# Altium schematic sheet Imx6ull.SchDoc
size 299 x 312 mm; SheetNumber: 3; SheetTotal: 4
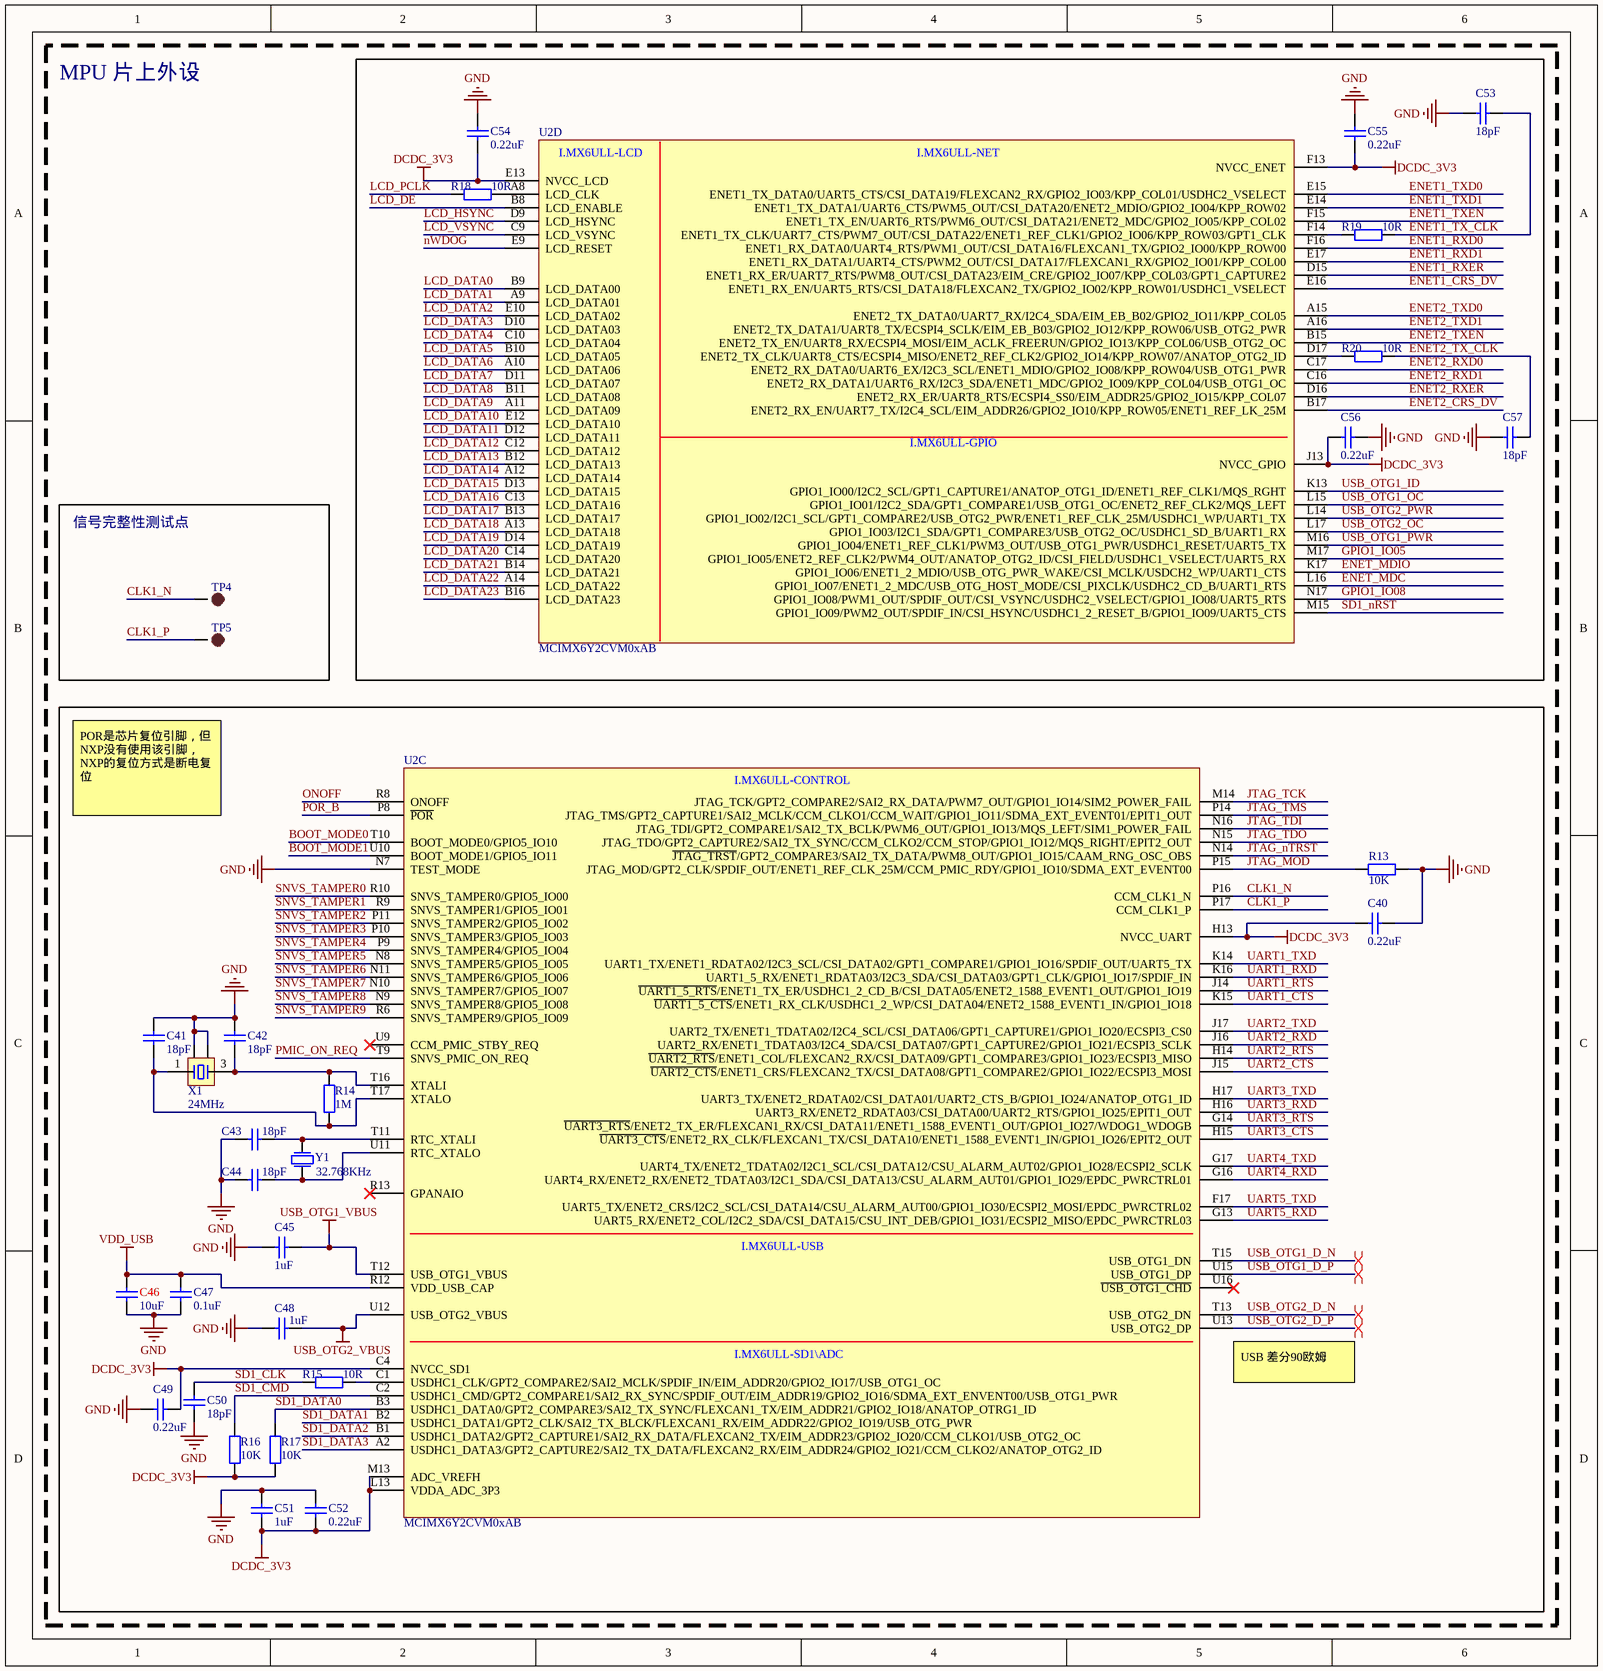
[diagram p0: Imx6ull.SchDoc]

## Parts
C40  0.22uF  [0402_C]
C41  18pF  [0402_C]
C42  18pF  [0402_C]
C43  18pF  [0402_C]
C44  18pF  [0402_C]
C45  1uF  [0402_C]
C46  10uF  [0603_C _MINI]
C47  0.1uF  [0402_C]
C48  1uF  [0402_C]
C49  0.22uF  [0402_C]
C50  18pF  [0402_C]
C51  1uF  [0402_C]
C52  0.22uF  [0402_C]
C53  18pF  [0402_C]
C54  0.22uF  [0402_C]
C55  0.22uF  [0402_C]
C56  0.22uF  [0402_C]
C57  18pF  [0402_C]
R13  10K  [0402_R]
R14  1M  [0402_R]
R15  10R  [0402_R]
R16  10K  [0402_R]
R17  10K  [0402_R]
R18  10R  [0402_R]
R19  10R  [0402_R]
R20  10R  [0402_R]
TP4  SOC_IN  [TP-1.0]  (value not drawn)
TP5  SOC_IN  [TP-1.0]  (value not drawn)
U2  MCIMX6Y2CVM0xAB  [BGA289_17x17_0.8Pitch]  (parts C,D of 5)
X1  24MHz  [OSC 3225-4P]
Y1  32.768KHz  [OSC 3215-2P]

## Blocks framed on the sheet
信号完整性测试点: TP4 TP5

## Nets
DCDC_3V3: C40.1 C49.2 C51.1 C52.1 C54.1 C55.1 C56.1 R16.1 R17.1 U2.C4(NVCC_SD1) U2.E13(NVCC_LCD) U2.F13(NVCC_ENET) U2.H13(NVCC_UART) U2.J13(NVCC_GPIO) U2.L13(VDDA_ADC_3P3) U2.M13(ADC_VREFH)
GND: C40.2 C41.2 C42.2 C43.1 C44.1 C45.1 C46.1 C47.1 C48.1 C49.1 C50.1 C51.2 C52.2 C53.2 C54.2 C55.2 C56.2 C57.1 R13.2 U2.N7(TEST_MODE) X1.2 X1.4
USB_OTG1_VBUS: C45.2 U2.T12(USB_OTG1_VBUS)
USB_OTG2_VBUS: C48.2 U2.U12(USB_OTG2_VBUS)
VDD_USB: C46.2 C47.2 U2.R12(VDD_USB_CAP)
BOOT_MODE0: U2.T10(BOOT_MODE0/GPIO5_IO10)
BOOT_MODE1: U2.U10(BOOT_MODE1/GPIO5_IO11)
CLK1_N: TP4.1 U2.P16(CCM_CLK1_N)
CLK1_P: TP5.1 U2.P17(CCM_CLK1_P)
ENET1_CRS_DV: U2.E16(ENET1_RX_EN/UART5_RTS/CSI_DATA18/FLEXCAN2_TX/GPIO2_IO02/KPP_ROW01/USDHC1_VSELECT)
ENET1_RXD0: U2.F16(ENET1_RX_DATA0/UART4_RTS/PWM1_OUT/CSI_DATA16/FLEXCAN1_TX/GPIO2_IO00/KPP_ROW00)
ENET1_RXD1: U2.E17(ENET1_RX_DATA1/UART4_CTS/PWM2_OUT/CSI_DATA17/FLEXCAN1_RX/GPIO2_IO01/KPP_COL00)
ENET1_RXER: U2.D15(ENET1_RX_ER/UART7_RTS/PWM8_OUT/CSI_DATA23/EIM_CRE/GPIO2_IO07/KPP_COL03/GPT1_CAPTURE2)
ENET1_TX_CLK: C53.1 R19.2
ENET1_TXD0: U2.E15(ENET1_TX_DATA0/UART5_CTS/CSI_DATA19/FLEXCAN2_RX/GPIO2_IO03/KPP_COL01/USDHC2_VSELECT)
ENET1_TXD1: U2.E14(ENET1_TX_DATA1/UART6_CTS/PWM5_OUT/CSI_DATA20/ENET2_MDIO/GPIO2_IO04/KPP_ROW02)
ENET1_TXEN: U2.F15(ENET1_TX_EN/UART6_RTS/PWM6_OUT/CSI_DATA21/ENET2_MDC/GPIO2_IO05/KPP_COL02)
ENET2_CRS_DV: U2.B17(ENET2_RX_EN/UART7_TX/I2C4_SCL/EIM_ADDR26/GPIO2_IO10/KPP_ROW05/ENET1_REF_LK_25M)
ENET2_RXD0: U2.C17(ENET2_RX_DATA0/UART6_EX/I2C3_SCL/ENET1_MDIO/GPIO2_IO08/KPP_ROW04/USB_OTG1_PWR)
ENET2_RXD1: U2.C16(ENET2_RX_DATA1/UART6_RX/I2C3_SDA/ENET1_MDC/GPIO2_IO09/KPP_COL04/USB_OTG1_OC)
ENET2_RXER: U2.D16(ENET2_RX_ER/UART8_RTS/ECSPI4_SS0/EIM_ADDR25/GPIO2_IO15/KPP_COL07)
ENET2_TX_CLK: C57.2 R20.2
ENET2_TXD0: U2.A15(ENET2_TX_DATA0/UART7_RX/I2C4_SDA/EIM_EB_B02/GPIO2_IO11/KPP_COL05)
ENET2_TXD1: U2.A16(ENET2_TX_DATA1/UART8_TX/ECSPI4_SCLK/EIM_EB_B03/GPIO2_IO12/KPP_ROW06/USB_OTG2_PWR)
ENET2_TXEN: U2.B15(ENET2_TX_EN/UART8_RX/ECSPI4_MOSI/EIM_ACLK_FREERUN/GPIO2_IO13/KPP_COL06/USB_OTG2_OC)
ENET_MDC: U2.L16(GPIO1_IO07/ENET1_2_MDC/USB_OTG_HOST_MODE/CSI_PIXCLK/USDHC2_CD_B/UART1_RTS)
ENET_MDIO: U2.K17(GPIO1_IO06/ENET1_2_MDIO/USB_OTG_PWR_WAKE/CSI_MCLK/USDCH2_WP/UART1_CTS)
GPIO1_IO05: U2.M17(GPIO1_IO05/ENET2_REF_CLK2/PWM4_OUT/ANATOP_OTG2_ID/CSI_FIELD/USDHC1_VSELECT/UART5_RX)
GPIO1_IO08: U2.N17(GPIO1_IO08/PWM1_OUT/SPDIF_OUT/CSI_VSYNC/USDHC2_VSELECT/GPIO1_IO08/UART5_RTS)
JTAG_MOD: R13.1 U2.P15(JTAG_MOD/GPT2_CLK/SPDIF_OUT/ENET1_REF_CLK_25M/CCM_PMIC_RDY/GPIO1_IO10/SDMA_EXT_EVENT00)
JTAG_nTRST: U2.N14(~{JTAG_TRST}/GPT2_COMPARE3/SAI2_TX_DATA/PWM8_OUT/GPIO1_IO15/CAAM_RNG_OSC_OBS)
JTAG_TCK: U2.M14(JTAG_TCK/GPT2_COMPARE2/SAI2_RX_DATA/PWM7_OUT/GPIO1_IO14/SIM2_POWER_FAIL)
JTAG_TDI: U2.N16(JTAG_TDI/GPT2_COMPARE1/SAI2_TX_BCLK/PWM6_OUT/GPIO1_IO13/MQS_LEFT/SIM1_POWER_FAIL)
JTAG_TDO: U2.N15(JTAG_TDO/GPT2_CAPTURE2/SAI2_TX_SYNC/CCM_CLKO2/CCM_STOP/GPIO1_IO12/MQS_RIGHT/EPIT2_OUT)
JTAG_TMS: U2.P14(JTAG_TMS/GPT2_CAPTURE1/SAI2_MCLK/CCM_CLKO1/CCM_WAIT/GPIO1_IO11/SDMA_EXT_EVENT01/EPIT1_OUT)
LCD_DATA0: U2.B9(LCD_DATA00)
LCD_DATA1: U2.A9(LCD_DATA01)
LCD_DATA2: U2.E10(LCD_DATA02)
LCD_DATA3: U2.D10(LCD_DATA03)
LCD_DATA4: U2.C10(LCD_DATA04)
LCD_DATA5: U2.B10(LCD_DATA05)
LCD_DATA6: U2.A10(LCD_DATA06)
LCD_DATA7: U2.D11(LCD_DATA07)
LCD_DATA8: U2.B11(LCD_DATA08)
LCD_DATA9: U2.A11(LCD_DATA09)
LCD_DATA10: U2.E12(LCD_DATA10)
LCD_DATA11: U2.D12(LCD_DATA11)
LCD_DATA12: U2.C12(LCD_DATA12)
LCD_DATA13: U2.B12(LCD_DATA13)
LCD_DATA14: U2.A12(LCD_DATA14)
LCD_DATA15: U2.D13(LCD_DATA15)
LCD_DATA16: U2.C13(LCD_DATA16)
LCD_DATA17: U2.B13(LCD_DATA17)
LCD_DATA18: U2.A13(LCD_DATA18)
LCD_DATA19: U2.D14(LCD_DATA19)
LCD_DATA20: U2.C14(LCD_DATA20)
LCD_DATA21: U2.B14(LCD_DATA21)
LCD_DATA22: U2.A14(LCD_DATA22)
LCD_DATA23: U2.B16(LCD_DATA23)
LCD_DE: U2.B8(LCD_ENABLE)
LCD_HSYNC: U2.D9(LCD_HSYNC)
LCD_PCLK: R18.1
LCD_VSYNC: U2.C9(LCD_VSYNC)
nWDOG: U2.E9(LCD_RESET)
ONOFF: U2.R8(ONOFF)
PMIC_ON_REQ: U2.T9(SNVS_PMIC_ON_REQ)
POR_B: U2.P8(~{POR})
SD1_CLK: C50.2 R15.1
SD1_CMD: R16.2 U2.C2(USDHC1_CMD/GPT2_COMPARE1/SAI2_RX_SYNC/SPDIF_OUT/EIM_ADDR19/GPIO2_IO16/SDMA_EXT_ENVENT00/USB_OTG1_PWR)
SD1_DATA0: R17.2 U2.B3(USDHC1_DATA0/GPT2_COMPARE3/SAI2_TX_SYNC/FLEXCAN1_TX/EIM_ADDR21/GPIO2_IO18/ANATOP_OTRG1_ID)
SD1_DATA1: U2.B2(USDHC1_DATA1/GPT2_CLK/SAI2_TX_BLCK/FLEXCAN1_RX/EIM_ADDR22/GPIO2_IO19/USB_OTG_PWR)
SD1_DATA2: U2.B1(USDHC1_DATA2/GPT2_CAPTURE1/SAI2_RX_DATA/FLEXCAN2_TX/EIM_ADDR23/GPIO2_IO20/CCM_CLKO1/USB_OTG2_OC)
SD1_DATA3: U2.A2(USDHC1_DATA3/GPT2_CAPTURE2/SAI2_TX_DATA/FLEXCAN2_RX/EIM_ADDR24/GPIO2_IO21/CCM_CLKO2/ANATOP_OTG2_ID)
SD1_nRST: U2.M15(GPIO1_IO09/PWM2_OUT/SPDIF_IN/CSI_HSYNC/USDHC1_2_RESET_B/GPIO1_IO09/UART5_CTS)
SNVS_TAMPER0: U2.R10(SNVS_TAMPER0/GPIO5_IO00)
SNVS_TAMPER1: U2.R9(SNVS_TAMPER1/GPIO5_IO01)
SNVS_TAMPER2: U2.P11(SNVS_TAMPER2/GPIO5_IO02)
SNVS_TAMPER3: U2.P10(SNVS_TAMPER3/GPIO5_IO03)
SNVS_TAMPER4: U2.P9(SNVS_TAMPER4/GPIO5_IO04)
SNVS_TAMPER5: U2.N8(SNVS_TAMPER5/GPIO5_IO05)
SNVS_TAMPER6: U2.N11(SNVS_TAMPER6/GPIO5_IO06)
SNVS_TAMPER7: U2.N10(SNVS_TAMPER7/GPIO5_IO07)
SNVS_TAMPER8: U2.N9(SNVS_TAMPER8/GPIO5_IO08)
SNVS_TAMPER9: U2.R6(SNVS_TAMPER9/GPIO5_IO09)
UART1_CTS: U2.K15(~{UART1_5_CTS}/ENET1_RX_CLK/USDHC1_2_WP/CSI_DATA04/ENET2_1588_EVENT1_IN/GPIO1_IO18)
UART1_RTS: U2.J14(~{UART1_5_}~{RTS}/ENET1_TX_ER/USDHC1_2_CD_B/CSI_DATA05/ENET2_1588_EVENT1_OUT/GPIO1_IO19)
UART1_RXD: U2.K16(UART1_5_RX/ENET1_RDATA03/I2C3_SDA/CSI_DATA03/GPT1_CLK/GPIO1_IO17/SPDIF_IN)
UART1_TXD: U2.K14(UART1_TX/ENET1_RDATA02/I2C3_SCL/CSI_DATA02/GPT1_COMPARE1/GPIO1_IO16/SPDIF_OUT/UART5_TX)
UART2_CTS: U2.J15(~{UART2_CTS}/ENET1_CRS/FLEXCAN2_TX/CSI_DATA08/GPT1_COMPARE2/GPIO1_IO22/ECSPI3_MOSI)
UART2_RTS: U2.H14(~{UART2_RTS}/ENET1_COL/FLEXCAN2_RX/CSI_DATA09/GPT1_COMPARE3/GPIO1_IO23/ECSPI3_MISO)
UART2_RXD: U2.J16(UART2_RX/ENET1_TDATA03/I2C4_SDA/CSI_DATA07/GPT1_CAPTURE2/GPIO1_IO21/ECSPI3_SCLK)
UART2_TXD: U2.J17(UART2_TX/ENET1_TDATA02/I2C4_SCL/CSI_DATA06/GPT1_CAPTURE1/GPIO1_IO20/ECSPI3_CS0)
UART3_CTS: U2.H15(~{UART3_CTS}/ENET2_RX_CLK/FLEXCAN1_TX/CSI_DATA10/ENET1_1588_EVENT1_IN/GPIO1_IO26/EPIT2_OUT)
UART3_RTS: U2.G14(~{UART3_RTS}/ENET2_TX_ER/FLEXCAN1_RX/CSI_DATA11/ENET1_1588_EVENT1_OUT/GPIO1_IO27/WDOG1_WDOGB)
UART3_RXD: U2.H16(UART3_RX/ENET2_RDATA03/CSI_DATA00/UART2_RTS/GPIO1_IO25/EPIT1_OUT)
UART3_TXD: U2.H17(UART3_TX/ENET2_RDATA02/CSI_DATA01/UART2_CTS_B/GPIO1_IO24/ANATOP_OTG1_ID)
UART4_RXD: U2.G16(UART4_RX/ENET2_RX/ENET2_TDATA03/I2C1_SDA/CSI_DATA13/CSU_ALARM_AUT01/GPIO1_IO29/EPDC_PWRCTRL01)
UART4_TXD: U2.G17(UART4_TX/ENET2_TDATA02/I2C1_SCL/CSI_DATA12/CSU_ALARM_AUT02/GPIO1_IO28/ECSPI2_SCLK)
UART5_RXD: U2.G13(UART5_RX/ENET2_COL/I2C2_SDA/CSI_DATA15/CSU_INT_DEB/GPIO1_IO31/ECSPI2_MISO/EPDC_PWRCTRL03)
UART5_TXD: U2.F17(UART5_TX/ENET2_CRS/I2C2_SCL/CSI_DATA14/CSU_ALARM_AUT00/GPIO1_IO30/ECSPI2_MOSI/EPDC_PWRCTRL02)
USB_OTG1_D_N: U2.T15(USB_OTG1_DN)
USB_OTG1_D_P: U2.U15(USB_OTG1_DP)
USB_OTG1_ID: U2.K13(GPIO1_IO00/I2C2_SCL/GPT1_CAPTURE1/ANATOP_OTG1_ID/ENET1_REF_CLK1/MQS_RGHT)
USB_OTG1_OC: U2.L15(GPIO1_IO01/I2C2_SDA/GPT1_COMPARE1/USB_OTG1_OC/ENET2_REF_CLK2/MQS_LEFT)
USB_OTG1_PWR: U2.M16(GPIO1_IO04/ENET1_REF_CLK1/PWM3_OUT/USB_OTG1_PWR/USDHC1_RESET/UART5_TX)
USB_OTG2_D_N: U2.T13(USB_OTG2_DN)
USB_OTG2_D_P: U2.U13(USB_OTG2_DP)
USB_OTG2_OC: U2.L17(GPIO1_IO03/I2C1_SDA/GPT1_COMPARE3/USB_OTG2_OC/USDHC1_SD_B/UART1_RX)
USB_OTG2_PWR: U2.L14(GPIO1_IO02/I2C1_SCL/GPT1_COMPARE2/USB_OTG2_PWR/ENET1_REF_CLK_25M/USDHC1_WP/UART1_TX)
NetC41_1: C41.1 R14.2 U2.T17(XTALO) X1.1
NetC42_1: C42.1 R14.1 U2.T16(XTALI) X1.3
NetC43_2: C43.2 U2.T11(RTC_XTALI) Y1.2(P2)
NetC44_2: C44.2 U2.U11(RTC_XTALO) Y1.1(P1)
NetR15_2: R15.2 U2.C1(USDHC1_CLK/GPT2_COMPARE2/SAI2_MCLK/SPDIF_IN/EIM_ADDR20/GPIO2_IO17/USB_OTG1_OC)
NetR18_2: R18.2 U2.A8(LCD_CLK)
NetR19_1: R19.1 U2.F14(ENET1_TX_CLK/UART7_CTS/PWM7_OUT/CSI_DATA22/ENET1_REF_CLK1/GPIO2_IO06/KPP_ROW03/GPT1_CLK)
NetR20_1: R20.1 U2.D17(ENET2_TX_CLK/UART8_CTS/ECSPI4_MISO/ENET2_REF_CLK2/GPIO2_IO14/KPP_ROW07/ANATOP_OTG2_ID)

Not connected (* = marked no-connect by the designer): U2 R13(GPANAIO)* U9(CCM_PMIC_STBY_REQ)* U16(~{USB_OTG1_CHD})*

## Layout directives
differential pair: USB_OTG1_D_N, USB_OTG1_D_P, USB_OTG2_D_N, USB_OTG2_D_P

## Notes on the sheet
- MPU 片上外设
- POR是芯片复位引脚，但NXP没有使用该引脚，NXP的复位方式是断电复位
- (near U2) USB 差分90欧姆
- (in symbol MCIMX6Y2CVM0xAB, part C) I.MX6ULL-CONTROL; I.MX6ULL-USB; I.MX6ULL-SD1\ADC
- (in symbol MCIMX6Y2CVM0xAB, part D) I.MX6ULL-LCD; I.MX6ULL-NET; I.MX6ULL-GPIO

## Library data of the parts
C40-C45 C47-C57 = 0402_C: 贴片电容; ComponentLink1Description: 供应商链接; ComponentLink1URL: http://www.szlcsc.com/product/details_1928.html; Package: 0402; Supplier: LC; SuppliersPartNumber: C1576
C46 = 0603_C_MINI: 贴片电容; ComponentLink1Description: 供应商链接; ComponentLink1URL: http://www.szlcsc.com/product/details_2037.html; Package: 0603; Supplier: LC; SuppliersPartNumber: C1685
R13-R20 = 0402_R: 贴片电阻; ComponentLink1Description: 供应商链接; ComponentLink1URL: http://www.szlcsc.com/product/details_26667.html; Package: 0402; Supplier: LC; SuppliersPartNumber: C25924
TP4 TP5 = TEST-POINT: 测试点
X1 = XTAL-4P: 4脚无源晶振; 版权归属: 源创客; BOM名称: 4脚无源晶振; 学习资源: www.ooocke.com
Y1 = XTAL-2P: 2脚无源晶振; ComponentLink1Description: 供应商链接; ComponentLink1URL: http://www.szlcsc.com/product/details_33310.html; Package: SMD-3215_2P; Supplier: LC; SuppliersPartNumber: C32346